# Altium schematic sheet M66BoardSCH.SchDoc
size C; SheetNumber: 1; SheetTotal: 1
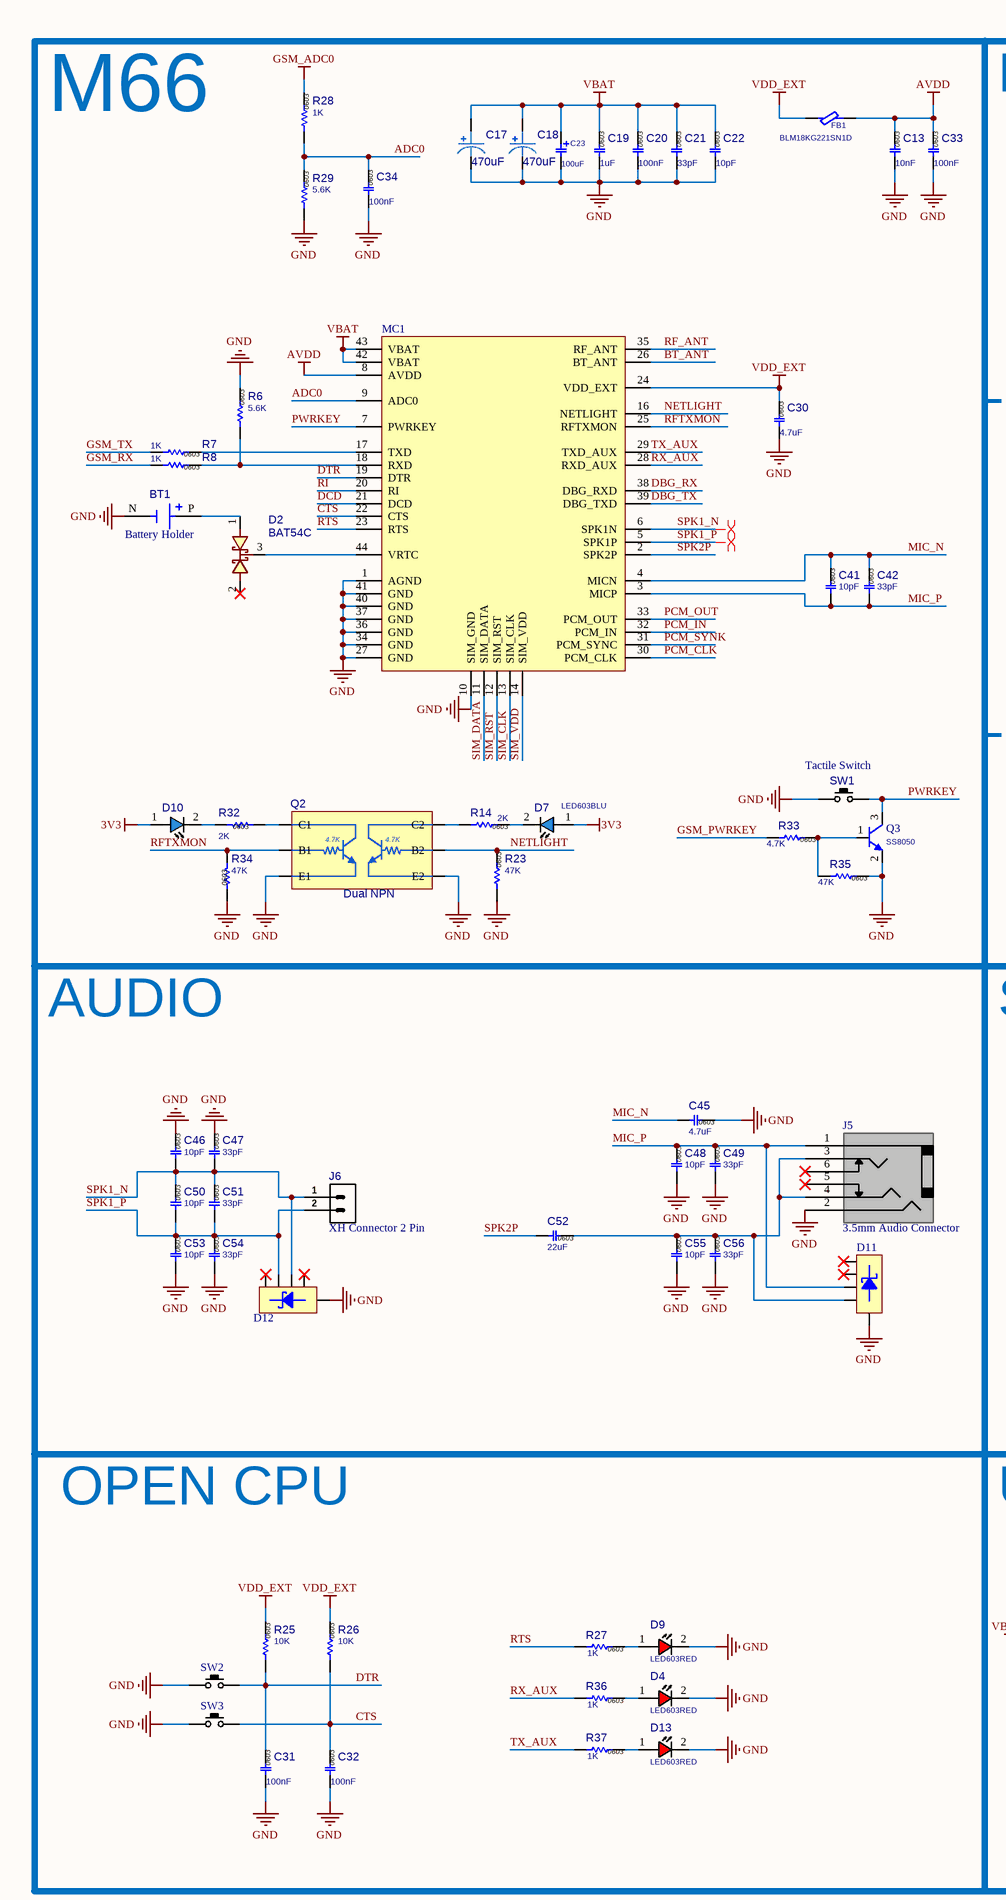
[diagram p0: M66BoardSCH.SchDoc, left]
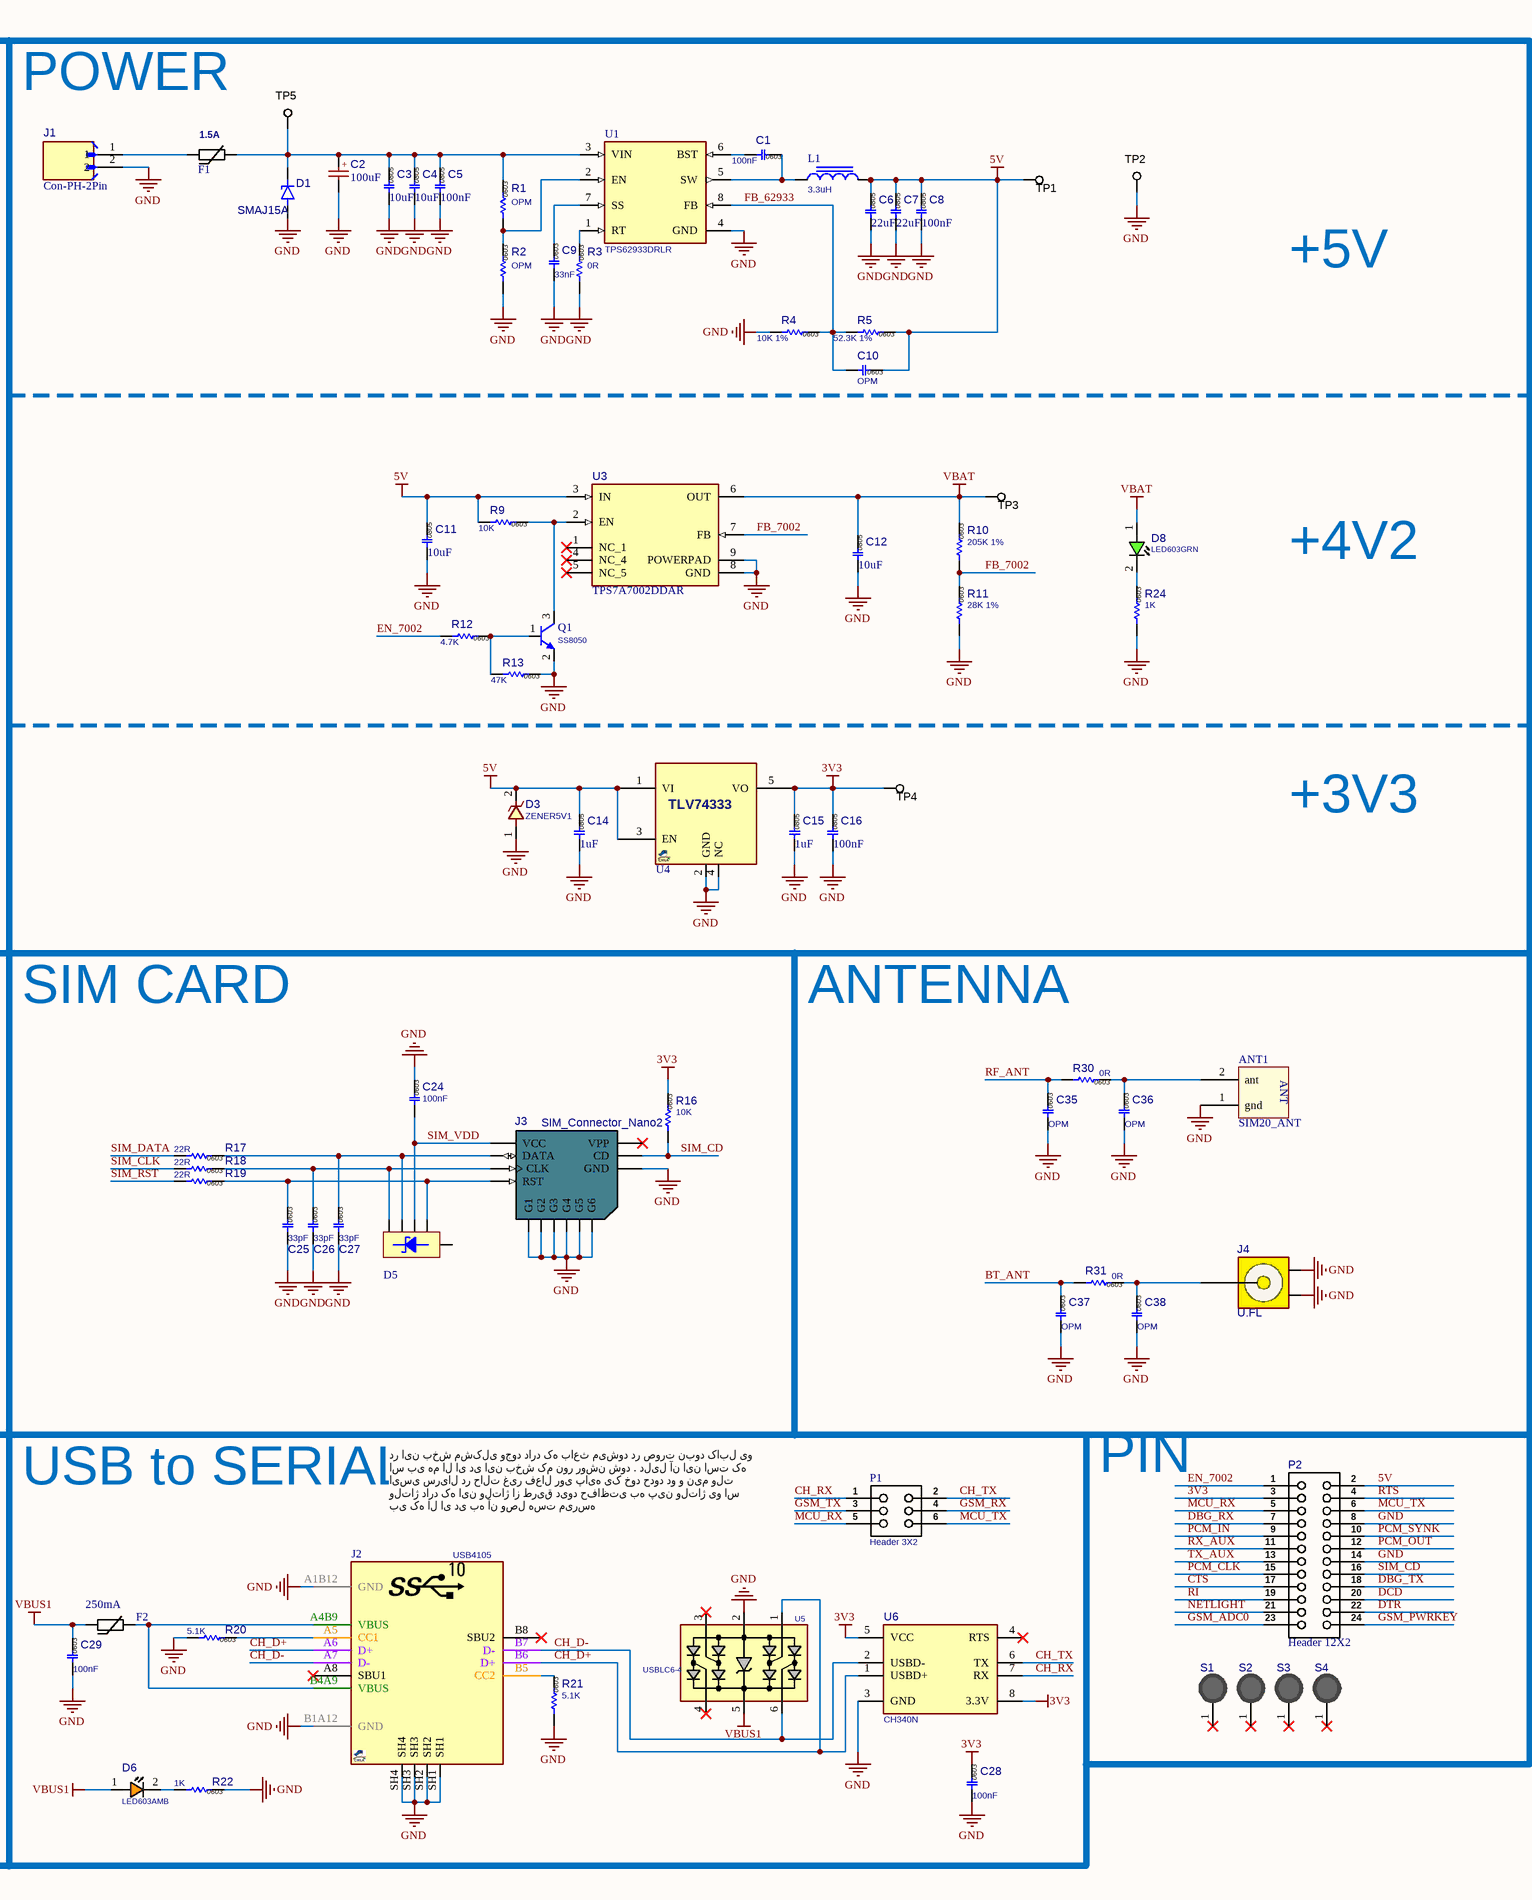
[diagram p1: M66BoardSCH.SchDoc, right]

## Parts
ANT1  SIM20_ANT  [MY_SIM20_ANT]
BT1  Battery Holder  [BS-06-B4AK008]
C1  100nF  [Cap SMD 0603]
C2  100uF  [Cap SMD 6.3x5.4mm]
C3  10uF  [Cap SMD 0805]
C4  10uF  [Cap SMD 0805]
C5  100nF  [Cap SMD 0805]
C6  22uF  [Cap SMD 0805]
C7  22uF  [Cap SMD 0805]
C8  100nF  [Cap SMD 0805]
C9  33nF  [Cap SMD 0603]
C10  OPM  [Cap SMD 0603]
C11  10uF  [Cap SMD 0805]
C12  10uF  [Cap SMD 0805]
C13  10nF  [Cap SMD 0603]
C14  1uF  [Cap SMD 0805]
C15  1uF  [Cap SMD 0805]
C16  100nF  [Cap SMD 0805]
C17  470uF  [Solid Capacitor 6.3x8mm]
C18  470uF  [Solid Capacitor 6.3x8mm]
C19  1uF  [Cap SMD 0603]
C20  100nF  [Cap SMD 0603]
C21  33pF  [Cap SMD 0603]
C22  10pF  [Cap SMD 0603]
C23  100uF  [C_TN_3528_BLK]
C24  100nF  [Cap SMD 0603]
C25  33pF  [Cap SMD 0603]
C26  33pF  [Cap SMD 0603]
C27  33pF  [Cap SMD 0603]
C28  100nF  [Cap SMD 0603]
C29  100nF  [Cap SMD 0603]
C30  4.7uF  [Cap SMD 0603]
C31  100nF  [Cap SMD 0603]
C32  100nF  [Cap SMD 0603]
C33  100nF  [Cap SMD 0603]
C34  100nF  [Cap SMD 0603]
C35  OPM  [Cap SMD 0603]
C36  OPM  [Cap SMD 0603]
C37  OPM  [Cap SMD 0603]
C38  OPM  [Cap SMD 0603]
C41  10pF  [Cap SMD 0603]
C42  33pF  [Cap SMD 0603]
C45  4.7uF  [Cap SMD 0603]
C46  10pF  [Cap SMD 0603]
C47  33pF  [Cap SMD 0603]
C48  10pF  [Cap SMD 0603]
C49  33pF  [Cap SMD 0603]
C50  10pF  [Cap SMD 0603]
C51  33pF  [Cap SMD 0603]
C52  22uF  [Cap SMD 0603]
C53  10pF  [Cap SMD 0603]
C54  33pF  [Cap SMD 0603]
C55  10pF  [Cap SMD 0603]
C56  33pF  [Cap SMD 0603]
D1  SMAJ15A  [SMAJ15A]
D2  BAT54C  [SOT23_3]
D3  ZENER5V1  [D_SOD123W]
D4  LED603RED  [LED0603RED]
D5  SMF-05  [SC70-5_N]  (value not drawn)
D6  LED603AMB  [LED0603AMB]
D7  LED603BLU  [LED0603BLU]
D8  LED603GRN  [LED0603GRN]
D9  LED603RED  [LED0603RED]
D10  LED603BLU  [LED0603BLU]  (value not drawn)
D11  SMF-05  [SC70-5_N]  (value not drawn)
D12  SMF-05  [SC70-5_N]  (value not drawn)
D13  LED603RED  [LED0603RED]
F1  1.5A  [FUSE1206 (3216)]
F2  250mA  [FUSE0603 (1608)]
FB1  BLM18KG221SN1D  [L0603]
J1  Con-PH-2Pin  [Con-PH-2Pin-RA]
J2  USB4105  [USBC_SMD_16_USB4105]
J3  SIM_Connector_Nano2  [SIM_Connector_Nano2]
J4  U.FL  [UFL]
J5  3.5mm Audio Connector  [PJ311D]
J6  XH Connector 2 Pin  [XH 2 Pin - 2.5mm]
L1  3.3uH  [SMD Inductor 3]
MC1  M66  [m66]  (value not drawn)
P1  Header 3X2  [HDR 2X3 Male Top]
P2  Header 12X2  [HDR 2X12 Male Top]
Q1  SS8050  [SOT23_3]
Q2  Dual NPN  [PUMH7]
Q3  SS8050  [SOT23_3]
R1  OPM  [Res SMD 0603]
R2  OPM  [Res SMD 0603]
R3  0R  [Res SMD 0603]
R4  10K 1%  [Res SMD 0603]
R5  52.3K 1%  [Res SMD 0603]
R6  5.6K  [Res SMD 0603]
R7  1K  [Res SMD 0603]
R8  1K  [Res SMD 0603]
R9  10K  [Res SMD 0603]
R10  205K 1%  [Res SMD 0603]
R11  28K 1%  [Res SMD 0603]
R12  4.7K  [Res SMD 0603]
R13  47K  [Res SMD 0603]
R14  2K  [Res SMD 0603]
R16  10K  [Res SMD 0603]
R17  22R  [Res SMD 0603]
R18  22R  [Res SMD 0603]
R19  22R  [Res SMD 0603]
R20  5.1K  [Res SMD 0603]
R21  5.1K  [Res SMD 0603]
R22  1K  [Res SMD 0603]
R23  47K  [Res SMD 0603]
R24  1K  [Res SMD 0603]
R25  10K  [Res SMD 0603]
R26  10K  [Res SMD 0603]
R27  1K  [Res SMD 0603]
R28  1K  [Res SMD 0603]
R29  5.6K  [Res SMD 0603]
R30  0R  [Res SMD 0603]
R31  0R  [Res SMD 0603]
R32  2K  [Res SMD 0603]
R33  4.7K  [Res SMD 0603]
R34  47K  [Res SMD 0603]
R35  47K  [Res SMD 0603]
R36  1K  [Res SMD 0603]
R37  1K  [Res SMD 0603]
S1  Screw 1  [Screw 1]  (value not drawn)
S2  Screw 1  [Screw 1]  (value not drawn)
S3  Screw 1  [Screw 1]  (value not drawn)
S4  Screw 1  [Screw 1]  (value not drawn)
SW1  Tactile Switch  [Tactil Switch 3*4*2]
SW2  Tactile Switch  [Tactile Switch]  (value not drawn)
SW3  Tactile Switch  [Tactile Switch]  (value not drawn)
TP1  TESTPOINT_SMD  [TPSMD_S1]  (value not drawn)  (no BOM)
TP2  TESTPOINT_SMD  [TPSMD_S1]  (value not drawn)  (no BOM)
TP3  TESTPOINT_SMD  [TPSMD_S1]  (value not drawn)  (no BOM)
TP4  TESTPOINT_SMD  [TPSMD_S1]  (value not drawn)  (no BOM)
TP5  TESTPOINT_SMD  [TPSMD_S1]  (value not drawn)  (no BOM)
U1  TPS62933DRLR  [TPS62933DRLR]
U3  TPS7A7002DDAR  [TPS7A7002DDAR]
U4  TLV74333  [SOT23_5]  (value not drawn)
U5  USBLC6-4  [SOT23_6]
U6  CH340N  [SO8_narrow_N]

## Blocks framed on the sheet
M66: BT1 C13 C17-C23 C30 C33 C34 C41 C42 D2 D7 D10 FB1 MC1 Q2 Q3 R6-R8 R14 R23 R28 R29 R32-R35 SW1

## Nets
3V3: C15.2 C16.2 C28.2 D7.1(ANODE) D10.1(ANODE) P2.3 R16.2 TP4.1 U4.5(VO) U6.5(VCC) U6.8(3.3V)
5V: C6.2 C7.2 C8.2 C10.2 C11.2 C14.2 D3.2 L1.2 P2.2 R5.2 R9.1 TP1.1 U3.3(IN) U4.1(VI) U4.3(EN)
AVDD: C13.2 C33.2 FB1.2 MC1.8(AVDD)
GND: ANT1.1(gnd) BT1.N(NEG) C2.2(-) C3.1 C4.1 C5.1 C6.1 C7.1 C8.1 C9.1 C11.1 C12.1 C13.1 C14.1 C15.1 C16.1 C17.2(N) C18.2(N) C19.1 C20.1 C21.1 C22.1 C23.2 C24.2 C25.1 C26.1 C27.1 C28.1 C29.1 C30.1 C31.1 C32.1 C33.1 C34.1 C35.1 C36.1 C37.1 C38.1 C45.2 C46.2 C47.2 C48.1 C49.1 C53.1 C54.1 C55.1 C56.1 D1.A D3.1 D4.2(CATHODE) D9.2(CATHODE) D11.2(K) D12.2(K) D13.2(CATHODE) J1.2 J2.A1B12(GND) J2.B1A12(GND) J2.SH1 J2.SH2 J2.SH3 J2.SH4 J3.C5(GND) J3.G1 J3.G2 J3.G3 J3.G4 J3.G5 J3.G6 J4.2(G1) J4.3(G2) J5.2(GND) MC1.1(AGND) MC1.10(SIM_GND) MC1.27(GND) MC1.34(GND) MC1.36(GND) MC1.37(GND) MC1.40(GND) MC1.41(GND) P2.8 P2.14 Q1.2(E) Q2.1(E1) Q2.4(E2) Q3.2(E) R2.1 R3.1 R4.1 R6.2 R11.1 R13.2 R20.1 R21.1 R22.2 R23.1 R24.1 R29.1 R34.1 R35.2 SW1.1(P1) SW2.1(P1) SW3.1(P1) TP2.1 U1.4(GND) U3.8(GND) U3.9(POWERPAD) U4.2(GND) U4.4(NC) U5.2 U6.3(GND)
GSM_ADC0: P2.23 R28.2
VBAT: C12.2 C17.1(P) C18.1(P) C19.2 C20.2 C21.2 C22.2 C23.1 D8.1(ANODE) MC1.42(VBAT) MC1.43(VBAT) R10.2 TP3.1 U3.6(OUT)
VBUS1: C29.2 D6.1(ANODE) F2.1 U5.5
VDD_EXT: C30.2 FB1.1 MC1.24(VDD_EXT) R25.2 R26.2
ADC0: C34.2 MC1.9(ADC0) R28.1 R29.2
BT_ANT: C37.2 MC1.26(BT_ANT) R31.1
CH_D+: J2.A6(D+) J2.B6(D+) U5.1 U6.1(USBD+)
CH_D-: J2.A7(D-) J2.B7(D-) U5.6 U6.2(USBD-)
CH_RX: P1.1 U6.7(RX)
CH_TX: P1.2 U6.6(TX)
CTS: C32.2 MC1.22(CTS) P2.17 R26.1 SW3.2(P3)
DBG_RX: MC1.38(DBG_RXD) P2.7
DBG_TX: MC1.39(DBG_TXD) P2.18
DCD: MC1.21(DCD) P2.20
DTR: C31.2 MC1.19(DTR) P2.22 R25.1 SW2.2(P3)
EN_7002: P2.1 R12.1
FB_7002: R10.1 R11.2 U3.7(FB)
FB_62933: C10.1 R4.2 R5.1 U1.8(FB)
GSM_PWRKEY: P2.24 R33.1
GSM_RX: P1.4 R8.1
GSM_TX: P1.3 R7.1
MCU_RX: P1.5 P2.5
MCU_TX: P1.6 P2.6
MIC_N: C41.2 C42.2 C45.1 MC1.4(MICN)
MIC_P: C41.1 C42.1 C48.2 C49.2 D11.4(K) J5.1(MIC) MC1.3(MICP)
NETLIGHT: MC1.16(NETLIGHT) P2.21 Q2.5(B2) R23.2
PCM_CLK: MC1.30(PCM_CLK) P2.15
PCM_IN: MC1.32(PCM_IN) P2.9
PCM_OUT: MC1.33(PCM_OUT) P2.12
PCM_SYNK: MC1.31(PCM_SYNC) P2.10
PWRKEY: MC1.7(PWRKEY) Q3.3(C) SW1.2(P3)
RF_ANT: C35.2 MC1.35(RF_ANT) R30.1
RFTXMON: MC1.25(RFTXMON) Q2.2(B1) R34.2
RI: MC1.20(RI) P2.19
RTS: MC1.23(RTS) P2.4 R27.1
RX_AUX: MC1.28(RXD_AUX) P2.11 R36.1
SIM_CD: J3.CD P2.16 R16.1
SIM_CLK: MC1.13(SIM_CLK) R18.1
SIM_DATA: MC1.11(SIM_DATA) R17.1
SIM_RST: MC1.12(SIM_RST) R19.1
SIM_VDD: C24.1 D5.4(K) J3.C1(VCC) MC1.14(SIM_VDD)
SPK1_N: C46.1 C47.1 C50.2 C51.2 D12.4(K) J6.1 MC1.6(SPK1N)
SPK1_P: C50.1 C51.1 C53.2 C54.2 D12.3(K) J6.2 MC1.5(SPK1P)
SPK2P: C52.1 MC1.2(SPK2P)
TX_AUX: MC1.29(TXD_AUX) P2.13 R37.1
NetANT1_2: ANT1.2(ant) C36.2 R30.2
NetBT1_P: BT1.P(POS) D2.1
NetC1_1: C1.1 U1.6(BST)
NetC1_2: C1.2 L1.1 U1.5(SW)
NetC2_1: C2.1(+) C3.2 C4.2 C5.2 D1.C F1.2 R1.2 TP5.1 U1.3(VIN)
NetC9_2: C9.2 U1.7(SS)
NetC25_2: C25.2 D5.5(K) J3.C2(RST) R19.2
NetC26_2: C26.2 D5.1(K) J3.C3(CLK) R18.2
NetC27_2: C27.2 D5.3(K) J3.C7(DATA) R17.2
NetC38_2: C38.2 J4.1(SIG) R31.2
NetC52_2: C52.2 C55.2 C56.2 D11.5(K) J5.3(SP_Right_OUT) J5.4(SP_Left_OUT)
NetD2_3: D2.3 MC1.44(VRTC)
NetD4_1: D4.1(ANODE) R36.2
NetD6_2: D6.2(CATHODE) R22.1
NetD7_2: D7.2(CATHODE) R14.2
NetD8_2: D8.2(CATHODE) R24.2
NetD9_1: D9.1(ANODE) R27.2
NetD10_2: D10.2(CATHODE) R32.2
NetD13_1: D13.1(ANODE) R37.2
NetF1_1: F1.1 J1.1
NetF2_2: F2.2 J2.A4B9(VBUS) J2.B4A9(VBUS)
NetJ2_A5: J2.A5(CC1) R20.2
NetJ2_B5: J2.B5(CC2) R21.2
NetMC1_17: MC1.17(TXD) R7.2
NetMC1_18: MC1.18(RXD) R6.1 R8.2
NetQ1_1: Q1.1(B) R12.2 R13.1
NetQ1_3: Q1.3(C) R9.2 U3.2(EN)
NetQ2_3: Q2.3(C2) R14.1
NetQ2_6: Q2.6(C1) R32.1
NetQ3_1: Q3.1(B) R33.2 R35.1
NetR1_1: R1.1 R2.2 U1.2(EN)
NetR3_2: R3.2 U1.1(RT)

Not connected (* = marked no-connect by the designer): D2 2*; D5 2(K); D11 1(K)* 3(K)*; D12 1(K)* 5(K)*; J2 A8(SBU1)* B8(SBU2)*; J3 C6(VPP)*; J5 5(SP_Left_IN)* 6(SP_Right_IN)*; S1 1*; S2 1*; S3 1*; S4 1*; U3 1(NC_1)* 4(NC_4)* 5(NC_5)*; U5 3* 4*; U6 4(RTS)*

## Layout directives
differential pair: SPK1_N, SPK1_P

## Notes on the sheet
- POWER
- +5V
- +4V2
- +3V3
- AUDIO
- SIM CARD
- ANTENNA
- PIN
- OPEN CPU
- USB to SERIAL
- در این بخش مشکلی وجود دارد که باعث میشود در صورت نبود کابل یو اس بی هم ال ای دی این بخش کم نور روشن شود . دلیل آن این است که ایسی سریال در حالت غیر فعال روی پایه یک خود حدود دو و نیم ولت ولتاژ دارد که این ولتاژ از طریق دیود حفاظتی به پین ولتاژ یو اس بی که ال ای دی به آن وصل هست میرسه
- (in symbol Cap SMD 0603) 0603
- (in symbol Cap SMD 0805) 0805
- (in symbol PUMH7) 4.7K
- (in symbol Res SMD 0603) 0603

## Library data of the parts
ANT1 = SIM20_ANT: ANT
C1 C20 C24 C28 C29 C31-C34 = Cap SMD 0603: VALUE: 100nF
C2 = CAP Electrolytic SMD: SMD Aluminum Electrolytic Capacitor; Desc: SMD Aluminum Electrolytic Capacitors; Voltage: 12v; Tolerance: 5%; Value: 100uF; Library Link: https://github.com/Majid-Derhambakhsh; Publisher: Majid Derhambakhsh
C3 C4 C6 C7 C11 C12 C14 C15 = Cap SMD 0805: VALUE: 100nF
C5 C8 C16 = Cap SMD 0805: VALUE: 100nF
C9 C10 C13 C19 C21 C22 C25-C27 C30 C35-C38 C41 C42 C45-C56 = Cap SMD 0603: VALUE: 100nF
C17 C18 = CAP Solid: Solid Polymer Electrolytic Capacitor; VALUE: 470uF
C23 = CAP_SMD_TAN_4: CAP, SMD, TAN; PARAM: 20%, 300mOhm, -55~105oC; MANF: VISHAY; MANF_P#: T55A106M6R3C0300; PARAM2: 6.3V; PRICE: 0.46$; VALUE: 100uF
D1 = SMAJ15A: TVS Diode Uni-directional 15V SMA  BR Voltage : 16.7V  Clamping Volatage : 24.4V
D2 = DIODE_SMD_SCHOTTKY_BAT54C: DIODE, SCHOTTKY, DUAL, 30V, 0.2A; MANF: Diodes; MANF_P#: BAT54C-7-F; DESC: DESCRIPTION; PARAM: 30V/200MW; ASSEMBLY: ASSEMBLY; PRICE: PRICE; PARAM2: 0.2A; VALUE: BAT54C
D3 = DIODE_SMD_ZENER_BZT52HC5V1: DIODE, ZENER, 1W, 5.1V; MANF: Diodes; DESC: DESCRIPTION; PARAM2: 1W, 4Ohm, -55~150oC; MANF_P#: BZT52HC5V1WF-7; ASSEMBLY: ASSEMBLY; PRICE: 0.25$; PARAM: 5.1V; VALUE: ZENER5V1
D4 D9 D13 = LED_SMD_0603_RED: LED, SMD, 0603, RED; PARAM: 30mA, 640nm; DESC: DESCRIPTION; MANF_P#: MANF_PART#; PARAM2: 1.8~2.5V; MANF: MANF; ASSEMBLY: ASSEMBLY; PRICE: PRICE; VALUE: LED603RED
D5 D11 D12 = Semi_Diod_TVS_SMF05: TVS Diode Array; Rating: Rating?; Validation: Valid; Inflow: inflow?; Type: TVS; Value: SMF-05; Package: SC70-5
D6 = LED_SMD_0603_AMB: LED, SMD, 0603, AMBER, 606nm; PARAM: 30mA; MANF: OSRAM; DESC: DESCRIPTION; MANF_P#: L29K-H2K1-24-Z; PARAM2: 1.8V; ASSEMBLY: ASSEMBLY; PRICE: PRICE; VALUE: LED603AMB
D7 D10 = LED_SMD_0603_BLU: LED, SMD, 0603, BLUE; PARAM: 30mA, 470nm, 120° Angle; DESC: DESCRIPTION; MANF_P#: MANF_PART#; PARAM2: 2.2~3V; MANF: MANF; ASSEMBLY: ASSEMBLY; PRICE: PRICE; VALUE: LED603BLU
D8 = LED_SMD_0603_GRN: LED, SMD, 0603, GREEN; PARAM: 20mA; MANF: Kingbright; DESC: DESCRIPTION; MANF_P#: APT1608SGC; PARAM2: 2.2V; ASSEMBLY: ASSEMBLY; PRICE: 1: 0.14$, 100: 6.8$; VALUE: LED603GRN
F1 F2 = PPTC Resettable Fuses: Publisher: Majid Derhambakhsh
  F1: Value: 1.5A
  F2: Value: 250mA
FB1 = FBEAD_SMD_BLM18PG121: FERRITE_Bead, 0603, 2A, 50mOhm, 120@100MHz; MANF: MURATA; MANF_P#: BLM18PG121SN1D; PARAM: 120@100MHz; PARAM2: 2A, 50mOhm; VALUE: BLM18KG221SN1D
J1 = Con-PH-2Pin: Connector Header Through Hole 2 position 0.079 (2.00mm)
J2 = CONN_USBC_SMD_16_USB4105: CONN, USB, Type C, USB 2.0, Right-Angle, SMD; MANF: GCT; MANF_P#: USB4105-GF-A; PARAM: 5A; Price: 1.5$; Value: USB4105
J3 = SIM_Connector_Nano2: Nano Sim Card 6P SMT-Card Detection
J4 = CONN_RF_UFL: CONN, RF, U.FL, STRAIGHT, Ultra Miniature Coaxial; MANF_P#: CONUFL001-SMD, U.FL-R-SMT-1(10), 128-0711-201; MANF: Linx, Hirose, Cinch; PARAM: 50Ohm, 6GHz; DESC: DESCRIPTION; DIST#: DIGIKEY, MOUSER; PARAM2: GOLD; ASSEMBLY: ASSEMBLY; PRICE: 0.9$; VALUE: U.FL
J5 = PJ311D
J6 = XH 2: XH, 2-Pin; Current: 3A; Library Link: https://github.com/Majid-Derhambakhsh; Publisher: Majid Derhambakhsh
L1 = SMD Inductor 3: 1008 (2520 metric) Part Number : DFE252012F-4R7M=P2
MC1 = ModSen_Com_M66: Quectel GSM/GPRS Module; Rating: Rating?; Validation: Valid; Inflow: inflow?; Package: Dip; Value: M66; Type: GSM-GPRS
P1 = Header 3X2: Header, 3-Pin, Dual row; Publisher: Majid Derhambakhsh; Library Link: https://github.com/Majid-Derhambakhsh
P2 = Header 12X2: Header, 12-Pin, Dual row; Library Link: https://github.com/Majid-Derhambakhsh; Publisher: Majid Derhambakhsh
Q1 Q3 = NPN_SS8050_SOT23: BJT, NPN, 25v, 1.5A, SMD, SOT23; PARAM2: 300mW; MANF: GALAXY; PARAM: 25v, 1.5A; MANF_P#: SS8050; VALUE: SS8050
Q2 = PUMH7: 2 NPN 50V 100mA Transistors (Resistor-Equipped R1 = 4.7kΩ) SOT-363
R1-R3 R5-R8 R10-R14 R17-R24 R27-R37 = Res SMD 0603: VALUE: 10K
R4 R9 R16 R25 R26 = Res SMD 0603: VALUE: 10K
SW1-SW3 = Tactile Switch: 3x6x5 mm - 2 Pin
TP1-TP5 = TESTPOINT_SMD: TEST POINT; MANF: MANF; MANF_P#: MANF_P#; VALUE: VALUE
U1 = TPS62933DRLR: 3.8-V to 30-V, 3-A, 200-kHz to 2.2-MHz, low-IQ synchronous buck converter in SOT-583 package
U3 = TPS7A7002DDAR: 3-A, low-VIN (1.4-V), adjustable ultra-low-dropout voltage regulator with enable 8-SO PowerPAD -40 to 125
U4 = VREG_TLV74333_SOT23: REG, Linear, LDO0.12V, Fixed, 300mA, VIN1.4~5.5V, VOUT1~5.5V, SOT-23-5; MANF: Texas Instruments; MANF_P#: TLV74333PDQN; PARAM2: 1.4~5.5Vin, LDO0.12V, Fixed3.0V; PARAM: 300mA, 50dB PSRR, -40~125°C; PRICE: $0.3; VALUE: TLV74333
U5 = TVS_X4_USBLC6-4SC6: TVS, ESD PROTECT, 4CH; MANF: ST; MANF_P#: USBLC6-4SC6; VALUE: USBLC6-4
U6 = IC_Converter_CH340N: TTL To USB Chip; Rating: Rating?; Validation: Valid; Inflow: inflow?; Type: USB to TTL; Package: SO-8; Value: CH340N